# EAGLE design O2_PROM_ISP_A00 (EAGLE 9.6.2)

## Sheet 1 of 2: RP2354B/USB/PWR
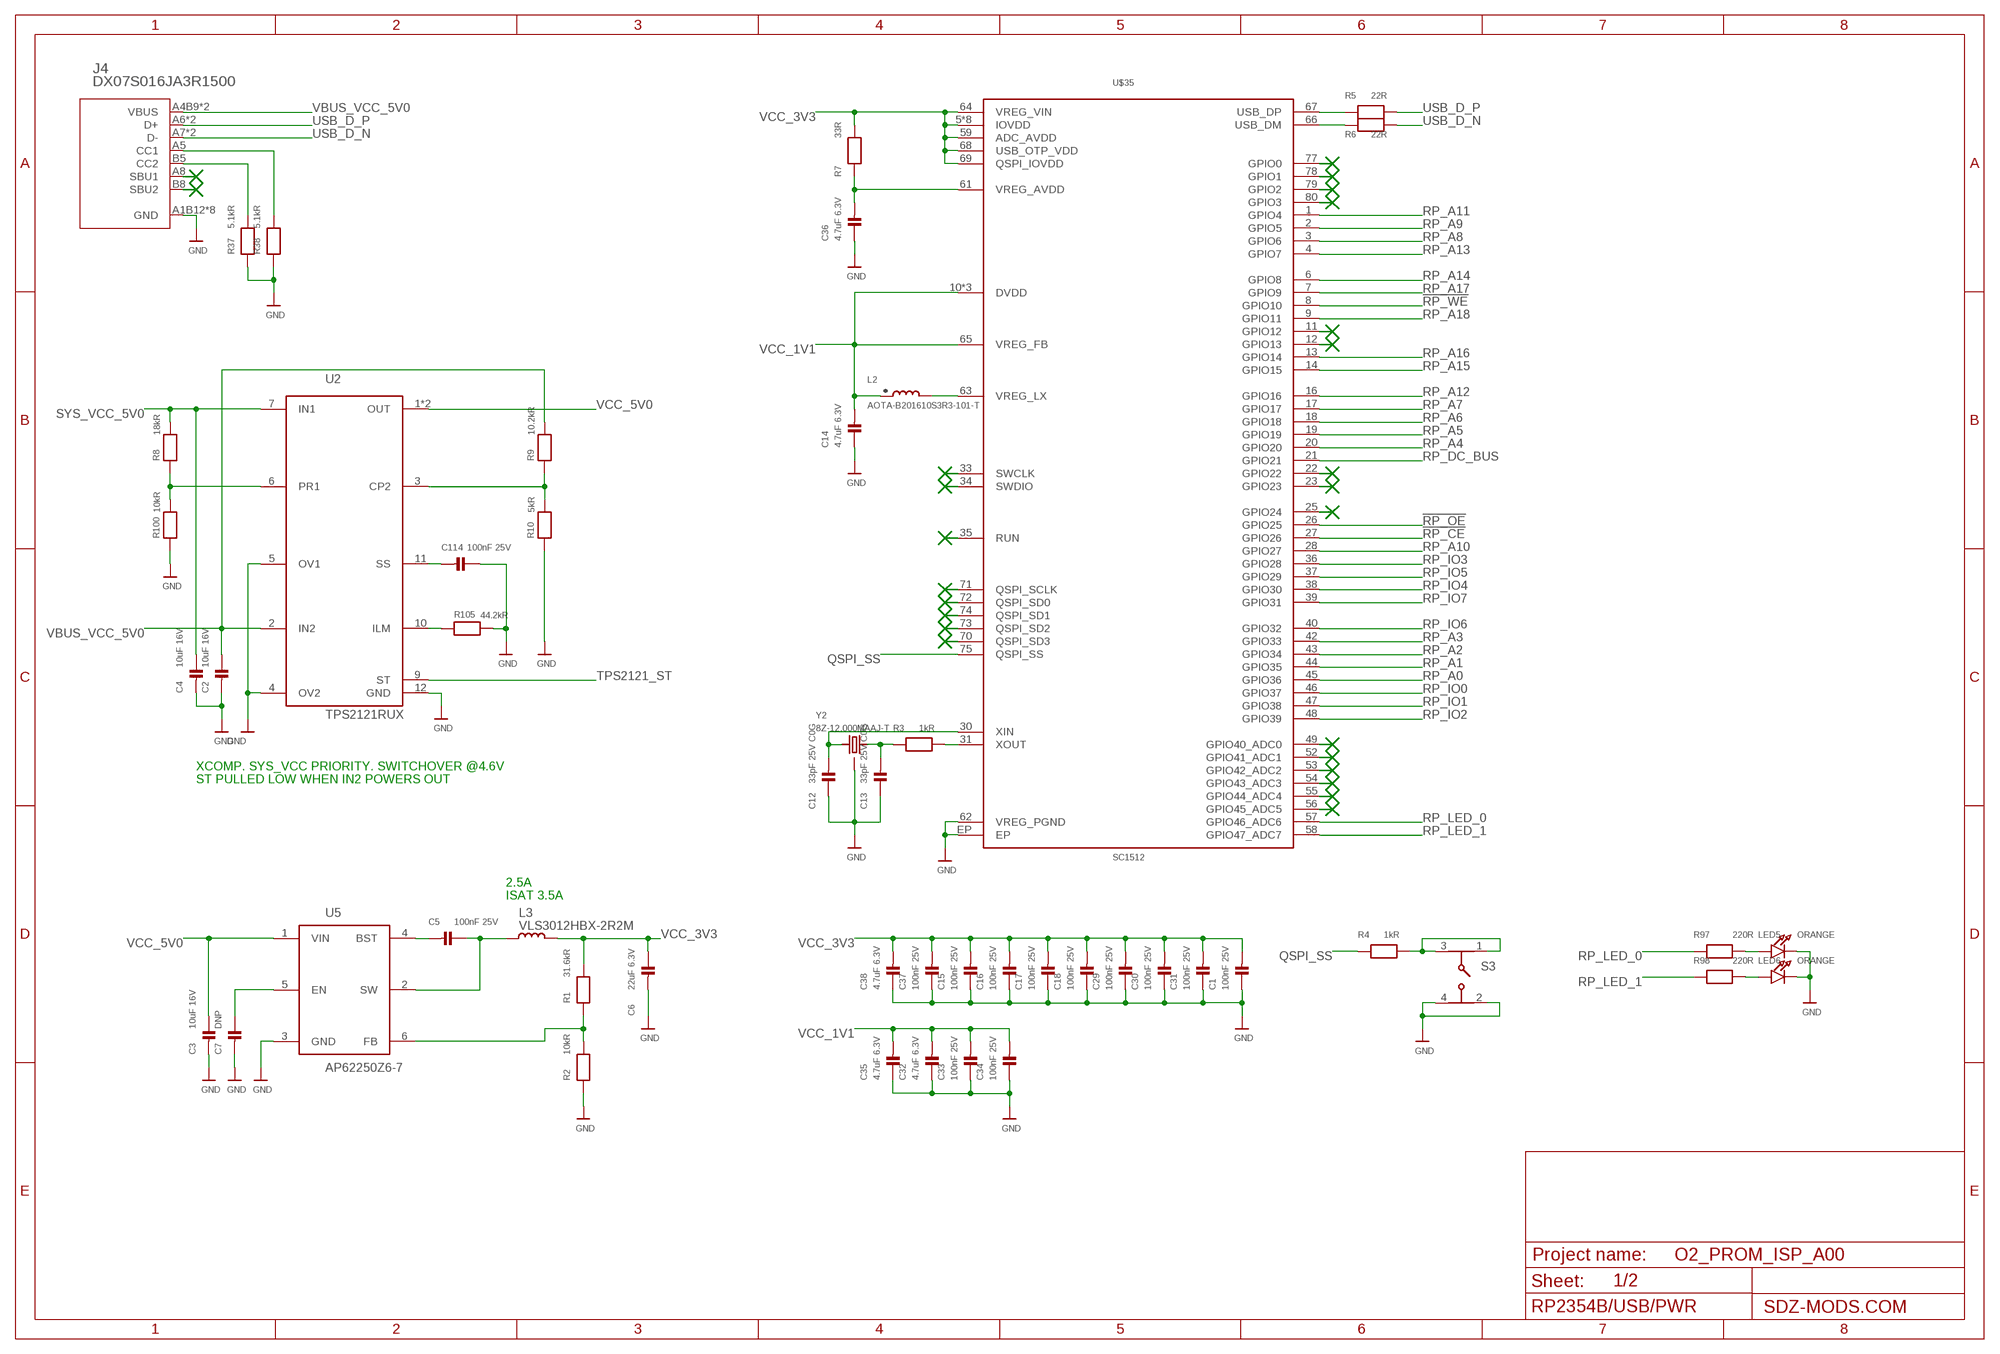
[diagram p0: schematic, sheet 1]

### Parts
C1  100nF 25V  CAP_CERAMIC0402D  [0402D]
C2  10uF 16V  CAP_CERAMIC0603D  [0603D]
C3  10uF 16V  CAP_CERAMIC0603D  [0603D]
C4  10uF 16V  CAP_CERAMIC0603D  [0603D]
C5  100nF 25V  CAP_CERAMIC0402D  [0402D]
C6  22uF 6.3V  CAP_CERAMIC0603D  [0603D]
C7  DNP  CAP_CERAMIC0402D  [0402D]
C12  33pF 25V C0G  CAP_CERAMIC0402D  [0402D]
C13  33pF 25V C0G  CAP_CERAMIC0402D  [0402D]
C14  4.7uF 6.3V  CAP_CERAMIC0402D  [0402D]
C15  100nF 25V  CAP_CERAMIC0402D  [0402D]
C16  100nF 25V  CAP_CERAMIC0402D  [0402D]
C17  100nF 25V  CAP_CERAMIC0402D  [0402D]
C18  100nF 25V  CAP_CERAMIC0402D  [0402D]
C29  100nF 25V  CAP_CERAMIC0402D  [0402D]
C30  100nF 25V  CAP_CERAMIC0402D  [0402D]
C31  100nF 25V  CAP_CERAMIC0402D  [0402D]
C32  4.7uF 6.3V  CAP_CERAMIC0402D  [0402D]
C33  100nF 25V  CAP_CERAMIC0402D  [0402D]
C34  100nF 25V  CAP_CERAMIC0402D  [0402D]
C35  4.7uF 6.3V  CAP_CERAMIC0402D  [0402D]
C36  4.7uF 6.3V  CAP_CERAMIC0402D  [0402D]
C37  100nF 25V  CAP_CERAMIC0402D  [0402D]
C38  4.7uF 6.3V  CAP_CERAMIC0402D  [0402D]
C114  100nF 25V  CAP_CERAMIC0402D  [0402D]
J4  DX07S016JA3R1500  [DX07S016JA3R1500]
L2  AOTA-B201610S3R3-101-T  [0806]
L3  VLS3012HBX-2R2M  [VLS3012]
LED5  ORANGE  LED  [CHIPLED_0402C]
LED6  ORANGE  LED  [CHIPLED_0402C]
R1  31.6kR  RESISTOR0402D  [0402D]
R2  10kR  RESISTOR0402D  [0402D]
R3  1kR  RESISTOR0402D  [0402D]
R4  1kR  RESISTOR0402D  [0402D]
R5  22R  RESISTOR0402D  [0402D]
R6  22R  RESISTOR0402D  [0402D]
R7  33R  RESISTOR0402D  [0402D]
R8  18kR  RESISTOR0402D  [0402D]
R9  10.2kR  RESISTOR0402D  [0402D]
R10  5kR  RESISTOR0402D  [0402D]
R37  5.1kR  RESISTOR0402D  [0402D]
R38  5.1kR  RESISTOR0402D  [0402D]
R97  220R  RESISTOR0402D  [0402D]
R98  220R  RESISTOR0402D  [0402D]
R100  10kR  RESISTOR0402D  [0402D]
R105  44.2kR  RESISTOR0402D  [0402D]
S3  434353045816  [434353045816]
U2  TPS2121RUX  [VQFN-HR-12]
U5  AP62250Z6-7  [SOTFL50P160X60-6N]
U$35  SC1512  [SC1512]
Y2  8Z-12.000MAAJ-T  TXC-8Z-25X20  [TXC-8Z-25X20]

### Nets
!RP_CE: U$35.27(GPIO26) ; also sheet 2
!RP_OE: U$35.26(GPIO25) ; also sheet 2
!RP_WE: U$35.8(GPIO10) ; also sheet 2
GND: C1.3 C2.2 C3.2 C4.2 C6.2 C7.4 C12.3 C13.3 C14.3 C15.3 C16.3 C17.3 C18.3 C29.3 C30.3 C31.3 C32.3 C33.3 C34.3 C35.3 C36.3 C37.3 C38.3 C114.3 J4.A1B12(GND) J4.A12/B1(GND) J4.MH1(GND) J4.MH2(GND) J4.MH3(GND) J4.MH4(GND) J4.MP1(GND) J4.MP2(GND) LED5.4(C) LED6.4(C) R2.4 R10.3 R37.3 R38.3 R100.3 R105.4 S3.2 S3.4 U2.4(OV2) U2.5(OV1) U2.12(GND) U5.3(GND) U$35.62(VREG_PGND) U$35.EP Y2.2(GND) Y2.4(GND) ; also sheet 2
N$1: J4.A5(CC1) R38.4
N$2: R9.3 R10.4 U2.3(CP2)
N$3: J4.B5(CC2) R37.4
N$4: LED5.3(A) R97.3
N$5: LED6.3(A) R98.3
N$7: C13.4 R3.3 Y2.3
N$8: C12.4 U$35.30(XIN) Y2.1
N$9: R3.4 U$35.31(XOUT)
N$10: R4.4 S3.1 S3.3
N$13: L2.2 U$35.63(VREG_LX)
N$16: C5.4 U5.4(BST)
N$17: C5.3 L3.1 U5.2(SW)
N$18: R1.4 R2.3 U5.6(FB)
N$19: C7.3 U5.5(EN)
N$20: C36.4 R7.4 U$35.61(VREG_AVDD)
N$21: C114.4 U2.11(SS)
N$22: R105.3 U2.10(ILM)
N$23: R8.3 R100.4 U2.6(PR1)
QSPI_SS: R4.3 U$35.75(QSPI_SS)
RP_A0: U$35.45(GPIO36) ; also sheet 2
RP_A1: U$35.44(GPIO35) ; also sheet 2
RP_A2: U$35.43(GPIO34) ; also sheet 2
RP_A3: U$35.42(GPIO33) ; also sheet 2
RP_A4: U$35.20(GPIO20) ; also sheet 2
RP_A5: U$35.19(GPIO19) ; also sheet 2
RP_A6: U$35.18(GPIO18) ; also sheet 2
RP_A7: U$35.17(GPIO17) ; also sheet 2
RP_A8: U$35.3(GPIO6) ; also sheet 2
RP_A9: U$35.2(GPIO5) ; also sheet 2
RP_A10: U$35.28(GPIO27) ; also sheet 2
RP_A11: U$35.1(GPIO4) ; also sheet 2
RP_A12: U$35.16(GPIO16) ; also sheet 2
RP_A13: U$35.4(GPIO7) ; also sheet 2
RP_A14: U$35.6(GPIO8) ; also sheet 2
RP_A15: U$35.14(GPIO15) ; also sheet 2
RP_A16: U$35.13(GPIO14) ; also sheet 2
RP_A17: U$35.7(GPIO9) ; also sheet 2
RP_A18: U$35.9(GPIO11) ; also sheet 2
RP_DC_BUS: U$35.21(GPIO21) ; also sheet 2
RP_IO0: U$35.46(GPIO37) ; also sheet 2
RP_IO1: U$35.47(GPIO38) ; also sheet 2
RP_IO2: U$35.48(GPIO39) ; also sheet 2
RP_IO3: U$35.36(GPIO28) ; also sheet 2
RP_IO4: U$35.38(GPIO30) ; also sheet 2
RP_IO5: U$35.37(GPIO29) ; also sheet 2
RP_IO6: U$35.40(GPIO32) ; also sheet 2
RP_IO7: U$35.39(GPIO31) ; also sheet 2
RP_LED_0: R97.4 U$35.57(GPIO46_ADC6)
RP_LED_1: R98.4 U$35.58(GPIO47_ADC7)
SYS_VCC_5V0: C4.1 R8.4 U2.7(IN1) ; also sheet 2
TPS2121_ST: U2.9(ST) ; also sheet 2
USB_D_C_N: R6.3 U$35.66(USB_DM)
USB_D_C_P: R5.3 U$35.67(USB_DP)
USB_D_N: J4.A7(D-) J4.B7(D-) R6.4
USB_D_P: J4.A6(D+) J4.B6(D+) R5.4
VBUS_VCC_5V0: C2.1 J4.A4B9(VBUS) J4.B4A9(VBUS) R9.4 U2.2(IN2)
VCC_1V1: C14.4 C32.4 C33.4 C34.4 C35.4 L2.1 U$35.10(DVDD) U$35.32(DVDD) U$35.51(DVDD) U$35.65(VREG_FB)
VCC_3V3: C1.4 C6.1 C15.4 C16.4 C17.4 C18.4 C29.4 C30.4 C31.4 C37.4 C38.4 L3.2 R1.3 R7.3 U$35.5(IOVDD) U$35.15(IOVDD) U$35.24(IOVDD) U$35.29(IOVDD) U$35.41(IOVDD) U$35.50(IOVDD) U$35.59(ADC_AVDD) U$35.60(IOVDD) U$35.64(VREG_VIN) U$35.68(USB_OTP_VDD) U$35.69(QSPI_IOVDD) U$35.76(IOVDD)
VCC_5V0: C3.1 U2.1(OUT) U2.8(OUT) U5.1(VIN) ; also sheet 2
Unconnected: J4.A8(SBU1) J4.B8(SBU2) U$35.11(GPIO12) U$35.12(GPIO13) U$35.22(GPIO22) U$35.23(GPIO23) U$35.25(GPIO24) U$35.33(SWCLK) U$35.34(SWDIO) U$35.35(RUN) U$35.49(GPIO40_ADC0) U$35.52(GPIO41_ADC1) U$35.53(GPIO42_ADC2) U$35.54(GPIO43_ADC3) U$35.55(GPIO44_ADC4) U$35.56(GPIO45_ADC5) U$35.70(QSPI_SD3) U$35.71(QSPI_SCLK) U$35.72(QSPI_SD0) U$35.73(QSPI_SD2) U$35.74(QSPI_SD1) U$35.77(GPIO0) U$35.78(GPIO1) U$35.79(GPIO2) U$35.80(GPIO3)

### Notes on the sheet
- XCOMP. SYS_VCC PRIORITY. SWITCHOVER @4.6V
- ST PULLED LOW WHEN IN2 POWERS OUT
- 2.5A
- ISAT 3.5A

## Sheet 2 of 2: FLASH/BUS_SWITCH/CTRL
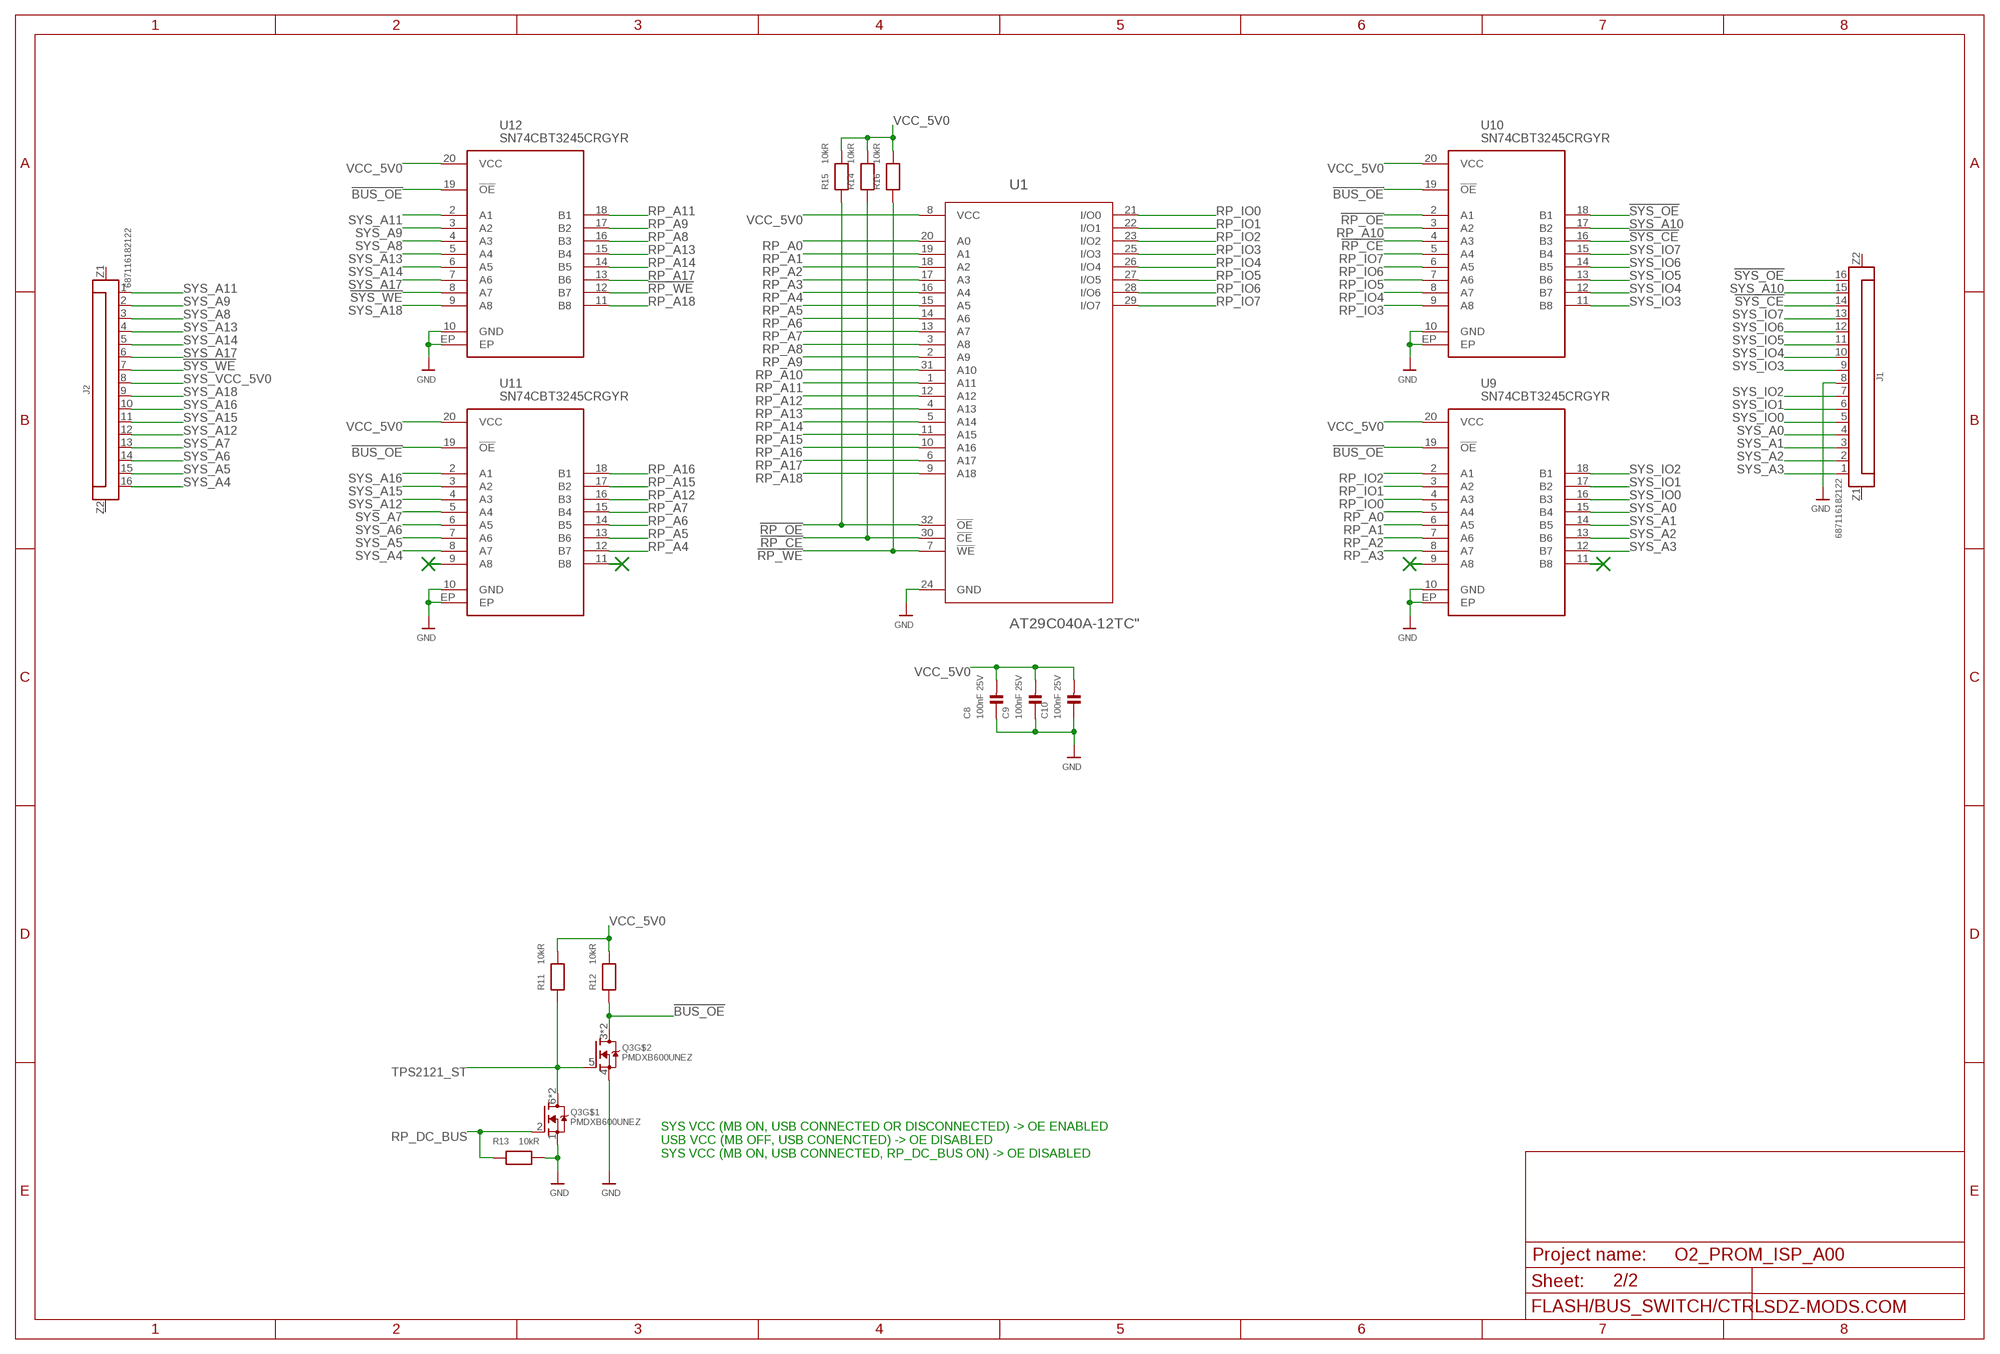
[diagram p1: schematic, sheet 2]

### Parts
C8  100nF 25V  CAP_CERAMIC0402D  [0402D]
C9  100nF 25V  CAP_CERAMIC0402D  [0402D]
C10  100nF 25V  CAP_CERAMIC0402D  [0402D]
J1  687116182122  6871XX182122_687116182122  [687116182122]
J2  687116182122  6871XX182122_687116182122  [687116182122]
Q3  PMDXB600UNEZ  [PMDXB600UNEZ]
R11  10kR  RESISTOR0402D  [0402D]
R12  10kR  RESISTOR0402D  [0402D]
R13  10kR  RESISTOR0402D  [0402D]
R14  10kR  RESISTOR0402D  [0402D]
R15  10kR  RESISTOR0402D  [0402D]
R16  10kR  RESISTOR0402D  [0402D]
U1  AT29C040A-12TC"  [TSOP32_8X20]
U9  SN74CBT3245CRGYR  [VQFN-20]
U10  SN74CBT3245CRGYR  [VQFN-20]
U11  SN74CBT3245CRGYR  [VQFN-20]
U12  SN74CBT3245CRGYR  [VQFN-20]

### Nets
!BUS_OE: Q3.3(D) Q3.8(D) R12.4 U9.19(!OE) U10.19(!OE) U11.19(!OE) U12.19(!OE)
!RP_CE: R14.4 U1.30(!CE) U10.4(A3) ; also sheet 1
!RP_OE: R15.4 U1.32(!OE) U10.2(A1) ; also sheet 1
!RP_WE: R16.4 U1.7(!WE) U12.12(B7) ; also sheet 1
!SYS_CE: J1.14 U10.16(B3)
!SYS_OE: J1.16 U10.18(B1)
!SYS_WE: J2.7 U12.8(A7)
GND: C8.3 C9.3 C10.3 J1.8 Q3.1(S) Q3.4(S) R13.3 U1.24(GND) U9.10(GND) U9.EP U10.10(GND) U10.EP U11.10(GND) U11.EP U12.10(GND) U12.EP ; also sheet 1
RP_A0: U1.20(A0) U9.5(A4) ; also sheet 1
RP_A1: U1.19(A1) U9.6(A5) ; also sheet 1
RP_A2: U1.18(A2) U9.7(A6) ; also sheet 1
RP_A3: U1.17(A3) U9.8(A7) ; also sheet 1
RP_A4: U1.16(A4) U11.12(B7) ; also sheet 1
RP_A5: U1.15(A5) U11.13(B6) ; also sheet 1
RP_A6: U1.14(A6) U11.14(B5) ; also sheet 1
RP_A7: U1.13(A7) U11.15(B4) ; also sheet 1
RP_A8: U1.3(A8) U12.16(B3) ; also sheet 1
RP_A9: U1.2(A9) U12.17(B2) ; also sheet 1
RP_A10: U1.31(A10) U10.3(A2) ; also sheet 1
RP_A11: U1.1(A11) U12.18(B1) ; also sheet 1
RP_A12: U1.12(A12) U11.16(B3) ; also sheet 1
RP_A13: U1.4(A13) U12.15(B4) ; also sheet 1
RP_A14: U1.5(A14) U12.14(B5) ; also sheet 1
RP_A15: U1.11(A15) U11.17(B2) ; also sheet 1
RP_A16: U1.10(A16) U11.18(B1) ; also sheet 1
RP_A17: U1.6(A17) U12.13(B6) ; also sheet 1
RP_A18: U1.9(A18) U12.11(B8) ; also sheet 1
RP_DC_BUS: Q3.2(G) R13.4 ; also sheet 1
RP_IO0: U1.21(I/O0) U9.4(A3) ; also sheet 1
RP_IO1: U1.22(I/O1) U9.3(A2) ; also sheet 1
RP_IO2: U1.23(I/O2) U9.2(A1) ; also sheet 1
RP_IO3: U1.25(I/O3) U10.9(A8) ; also sheet 1
RP_IO4: U1.26(I/O4) U10.8(A7) ; also sheet 1
RP_IO5: U1.27(I/O5) U10.7(A6) ; also sheet 1
RP_IO6: U1.28(I/O6) U10.6(A5) ; also sheet 1
RP_IO7: U1.29(I/O7) U10.5(A4) ; also sheet 1
SYS_A0: J1.4 U9.15(B4)
SYS_A1: J1.3 U9.14(B5)
SYS_A2: J1.2 U9.13(B6)
SYS_A3: J1.1 U9.12(B7)
SYS_A4: J2.16 U11.8(A7)
SYS_A5: J2.15 U11.7(A6)
SYS_A6: J2.14 U11.6(A5)
SYS_A7: J2.13 U11.5(A4)
SYS_A8: J2.3 U12.4(A3)
SYS_A9: J2.2 U12.3(A2)
SYS_A10: J1.15 U10.17(B2)
SYS_A11: J2.1 U12.2(A1)
SYS_A12: J2.12 U11.4(A3)
SYS_A13: J2.4 U12.5(A4)
SYS_A14: J2.5 U12.6(A5)
SYS_A15: J2.11 U11.3(A2)
SYS_A16: J2.10 U11.2(A1)
SYS_A17: J2.6 U12.7(A6)
SYS_A18: J2.9 U12.9(A8)
SYS_IO0: J1.5 U9.16(B3)
SYS_IO1: J1.6 U9.17(B2)
SYS_IO2: J1.7 U9.18(B1)
SYS_IO3: J1.9 U10.11(B8)
SYS_IO4: J1.10 U10.12(B7)
SYS_IO5: J1.11 U10.13(B6)
SYS_IO6: J1.12 U10.14(B5)
SYS_IO7: J1.13 U10.15(B4)
SYS_VCC_5V0: J2.8 ; also sheet 1
TPS2121_ST: Q3.5(G) Q3.6(D) Q3.7(D) R11.4 ; also sheet 1
VCC_5V0: C8.4 C9.4 C10.4 R11.3 R12.3 R14.3 R15.3 R16.3 U1.8(VCC) U9.20(VCC) U10.20(VCC) U11.20(VCC) U12.20(VCC) ; also sheet 1
Unconnected: J1.Z1 J1.Z2 J2.Z1 J2.Z2 U9.9(A8) U9.11(B8) U11.9(A8) U11.11(B8)

### Notes on the sheet
- SYS VCC (MB ON, USB CONNECTED OR DISCONNECTED) -> OE ENABLED
  USB VCC (MB OFF, USB CONENCTED) -> OE DISABLED
  SYS VCC (MB ON, USB CONNECTED, RP_DC_BUS ON) -> OE DISABLED

## Library data of the parts
C1-C10 C12-C18 C29-C38 C114 = microbuilder:CAP_CERAMIC: Ceramic Capacitors 0402 - 0402 Surface Mount Capacitors 16pF 50V 5% [Digikey: 445-4899-2-ND] 18pF 50V 5% [Digikey: 490-1281-2-ND] 22pF 50V 5% [Digikey: 490-1283-2-ND] 68pF 50V 5% [Digikey: 490-1289-2-ND] 0.1uF 10V 10% [Digikey: 490-1318-2-ND] 1.0uF 6.3V 10% [Digikey: 490-1320-2-ND] 0603 - 0603 Surface Mount Capacitors 16 pF 50V 5% [Digikey: 445-5051-2-ND] 22 pF 50V [Digikey: PCC220ACVTR-ND] 33 pF 50V 5% [Digikey: 490-1415-1-ND] 56pF 50V 5% [Digikey: 490-1421-1-ND] 220pF 50V 5% [Digikey: 445-1285-1-ND] 680 pF 50V 2200 pF 50V 5% C0G [Digikey: 445-1297-1-ND] 5600 pF 100V 5% X7R [Digikey: 478-3711-1-ND] 0.1 µF 25V 10% [Digikey: PCC2277TR-ND] 0.22 µF 16V 10% X7R [Digikey: 445-1318-1-ND] 1.0 µF 25V 10% [Digikey: 445-5146-2-ND] 0603 - RF Specific 3pF 250V +/-0.1pF RF [Digikey: 712-1347-1-ND] 18 pF 250V 5% [Digikey: 478-3505-1-ND or 712-1322-1-ND] 56 pF 250V 5% C0G RF [Digikey: 490-4867-1-ND] 68 pF 250V RF [Digikey: 490-4868-1-ND] 0805 - 0805 Surface Mount Capacitors 220 pF 250V 2% RF Ceramic Capacitor [Digikey: 712-1398-1-ND] 1000 pF 50V 2% NP0 Ceramic Capacitor [Digikey: 478-3760-1-ND] 0.1 µF 25V 10% Ceramic Capacitor [Digikey: PCC1828TR-ND] 1.0 µF 16V 10% Ceramic Capacitor[Digikey: 490-1691-2-ND] 10.0 µF 10V 10% Ceramic Capacitor[Digikey: 709-1228-1-ND] 10.0 uF 16V 10% Ceramic Capacitor [Digikey: 478-5165-2-ND] 47 uF 6.3V 20% Ceramic Capacitor [Digikey: 587-1779-1-ND or 399-5506-1-ND] 1206 - 1206 Surface Mount Capacitors 47uF 10V 20% Ceramic Capacitor [Digikey: 490-5528-1-ND or 399-5508-1-ND or 445-6010-1-ND] 100uF 6.3V -20%, +80% Y5V Ceramic Capacitor (Digikey: 490-4512-1-ND, Mouser: 81-GRM31CF50J107ZE1L)
J1 J2 = Eagle_WR-FPC (rev24a):6871XX182122_687116182122: WR-FPC 0.50 mm SMT ZIF Horizontal Dual Contact KIND PROPERTIES Pitch 0.5 mm MATERIAL PROPERTIES Insulator Material LCP Contact Material Phosphor Bronze Contact Plating 80 (µ") Tin over 50 (µ") Nickel Contact Type Stamped Solder Tabs Brass <https://www.we-online.com/catalog/media/o73336v209%20Family_WR-FPC_687186182122.jpg> Details see: https://www.we-online.com/catalog/en/FPC_0_5_SMT_ZIF_HORIZONTAL_DUAL_CONTACT_BACK_LOCKING_6871XX182122/ Updated by Ella Wu 2020-08-26 2020(C) Wurth Elektronik; CONTACT-RESISTANCE: 30mOhm; DATASHEET-URL: https://www.we-online.com/redexpert/spec/687116182122?ae; IR: 0.5A; L: 10mm; PACKAGING: Tape and Reel; PART-NUMBER: 687116182122; PINS: 16; PITCH: 0.5mm; TYPE: Horizontal; WORKING-VOLTAGE: 50V(AC)
J4 = DX07S016JA3R1500:DX07S016JA3R1500
L2 = AOTA-B201610S3R3-101-T:AOTA-B201610S3R3-101-T
L3 = VLS3012HBX-2R2M:VLS3012HBX-2R2M: Fixed Inductors 3x3x1.2mm 2.2uH 20% Magnetic Pwr Inductr Source: Datasheet <https://product.tdk.com/system/files/dam/doc/product/inductor/inductor/smd/catalog/inductor_commercial_power_vls3012hbx_en.pdf>; DESCRIPTION: Fixed Inductors 3x3x1.2mm 2.2uH 20% Magnetic Pwr Inductr; HEIGHT: mm; MANUFACTURER_NAME: TDK; MANUFACTURER_PART_NUMBER: VLS3012HBX-2R2M; MOUSER_PART_NUMBER: 810-VLS3012HBX-2R2M; MOUSER_PRICE-STOCK: https://www.mouser.co.uk/ProductDetail/TDK/VLS3012HBX-2R2M?qs=pfd5qewlna6oSgcfnWnTMg%3D%3D
LED5 LED6 = microbuilder:LED: LED 0603 - 0603 Surface Mount Package 2mA: Green LED - Low Power (3.9mcd, 2ma, 1.7Vf) - Digikey: 475-2709-2-ND Orange LED - Low Power (9.8mcd, 2ma, 1.8Vf) - Digikey: 475-1194-2-ND Red LED - Low Power (5mcd, 2ma, 1.8Vf) - Digikey: 475-1195-2-ND Yellow LED - Low Power (7mcd, 2ma, 1.8Vf) - Digikey: 475-1196-2-ND 5mA: Blue LED - Low Power (17mcd, 5ma, 2.9Vf) - Digikey: LNJ937W8CRACT-ND 0805 - 0805 Surface Mount Package 2mA: Red LED (8.8mcd, 2mA, 1.8Vf, Clear) - Low Power [Digikey: 475-2510-1-ND] Green LED (5mcd, 2mA, 1.8Vf, Clear) - Low Power [Digikey: 475-2730-1-ND] Yellow LED (11.3mcd, 2mA, 1.8Vf, Clear) - Low Power [Digikey: 475-2555-1-ND] 20mA: Red LED (104mcd, 20mA, Diffused) - LS R976 [Digikey: 475-1278-6-ND] Red LED (12mcd, 20mA, 2.0Vf, Clear) - APT2012EC [Digikey: 754-1128-1-ND] Green LED (15mcd, 20mA, 2.2Vf, Clear) - APT2012GC [Digikey: 754-1131-1-ND] Orange LED (160mcd, 20mA, 2.1Vf, Clear) - APT2012SECK [Digikey: 754-1130-1-ND] 1206 - 1206 Surface Mount Package Green LED (26mcd, 20mA, Diffused) - LG N971 [Digikey: 475-1407-6-ND] Red LED (15mcd, 20mA, Diffused) - LH N974 [Digikey: 475-1416-6-ND]
Q3 = PMDXB600UNEZ:PMDXB600UNEZ: PMDXB600UNEZ Hex N-Channel MOSFET, 600 mA, 20 V, 8-Pin DFN1010B-6, SOT1216 Nexperia Source: Datasheet <http://assets.nexperia.com/documents/data-sheet/PMDXB600UNE.pdf>; DESCRIPTION: PMDXB600UNEZ Hex N-Channel MOSFET, 600 mA, 20 V, 8-Pin DFN1010B-6, SOT1216 Nexperia; HEIGHT: 0.4mm; MANUFACTURER_NAME: Nexperia; MANUFACTURER_PART_NUMBER: PMDXB600UNEZ; MOUSER_PART_NUMBER: 771-PMDXB600UNEZ; MOUSER_PRICE-STOCK: https://www.mouser.co.uk/ProductDetail/Nexperia/PMDXB600UNEZ/?qs=gNSudQoqUYA4PlgBT4gR6w%3D%3D
R1-R16 R37 R38 R97 R98 R100 R105 = microbuilder:RESISTOR: Resistors 0402 - 0402 Surface Mount Package 22 Ohm 1% 1/16W [Digikey: 311-22.0LRTR-ND] 33 Ohm 5% 1/16W 1.0K 5% 1/16W 1.5K 5% 1/16W 2.0K 1% 1/16W 10.0K 1% 1/16W [Digikey: 311-10.0KLRTR-ND] 10.0K 5% 1/16W [Digikey: RMCF0402JT10K0TR-ND] 12.1K 1% 1/16W [Digikey: 311-22.0LRTR-ND] 100.0K 5% 1/16W 0603 - 0603 Surface Mount Package 0 Ohm 1/10 Watt 1% Resistor 15 Ohm 1/10 Watt 1% Resistor 33 Ohm 1/10 Watt 1% Resistor 49.9 Ohm 1/10 Watt 1% Resistor 100 Ohm 1/10 Watt 1% Resistor 150 Ohm 1/10 Watt 1% Resistor 240 Ohm 1/10 Watt 1% Resistor 390 Ohm 1/10 Watt 1% Resistor 560 Ohm 1/10 Watt 1% Resistor 680 Ohm 1/10 Watt 1% Resistor 750 Ohm 1/10 Watt 1% Resistor 1.0K Ohm 1/10 Watt 1% Resistor 1.5K Ohm 1/10 Watt 1% Resistor 2.0K Ohm 1/10 Watt 1% Resistor 2.2K Ohm 1/10 Watt 1% Resistor 3.3K Ohm 1/10 Watt 1% Resistor 4.7K Ohm 1/10 Watt 1% Resistor 10.0K Ohm 1/10 Watt 1% Resistor 12.0K Ohm 1/10 Watt 1% Resistor 12.1K Ohm 1/10 Watt 1% Resistor 20.0K Ohm 1/10 Watt 1% Resistor 33.0K Ohm 1/10 Watt 1% Resistor 100.0K Ohm 1/10 Watt 1% Resistor 0805 - 0805 Surface Mount Package 0 Ohm 1/8 Watt 1% Resistor 33 Ohm 1/8 Watt 1% Resistor 100 Ohm 1/8 Watt 1% Resistor 150 Ohm 1/8 Watt 1% Resistor 200 Ohm 1/8 Watt 1% Resistor 240 Ohm 1/8 Watt 1% Resistor 330 Ohm 1/8 Watt 1% Resistor 390 Ohm 1/8 Watt 1% Resistor 470 Ohm 1/8 Watt 1% Resistor 1.0K Ohm 1/8 Watt 1% Resistor 1.5K Ohm 1/8 Watt 1% Resistor 2.0K Ohm 1/8 Watt 1% Resistor 4.7K Ohm 1/8 Watt 1% Resistor 5.1K Ohm 1/8 Watt 1% Resistor 5.6K Ohm 1/8 Watt 1% Resistor 10.0K Ohm 1/8 Watt 1% Resistor 22.0K Ohm 1/8 Watt 1% Resistor 33.0K Ohm 1/8 Watt 1% Resistor 100K Ohm 1/8 Watt 1% Resistor 1206 - 1206 Surface Mount Package 2012 - 2010 Surface Mount Package 0.11 Ohm 1/2 Watt 1% Resistor - Digikey: RHM.11UCT-ND
S3 = Eagle_SWITCHES(rev19a):434353045816: 3.5x4.7 mm SMD J-Bend side push WS-TASU <http://katalog.we-online.de/media/images/v2/Family_WS_TUS_Normal_SMD_J-Bend_4343x30458xx_pf2.jpg> Details see: http://katalog.we-online.de/em/datasheet/4343x30458xx.pdf 2015 (C) Wurth Elektronik
U1 = AT29C040A-12TC:AT29C040A-12TC
U2 = TPS2121RUX:TPS2121RUX
U5 = AP62250Z6-7:AP62250Z6-7: Switching Voltage Regulators DCDC Conv HV Buck SOT563 T&R 3K Source: Datasheet <https://www.diodes.com/assets/Datasheets/AP62250.pdf>; DESCRIPTION: Switching Voltage Regulators DCDC Conv HV Buck SOT563 T&R 3K; HEIGHT: 0.6mm; MANUFACTURER_NAME: Diodes Inc.; MANUFACTURER_PART_NUMBER: AP62250Z6-7; MOUSER_PART_NUMBER: 621-AP62250Z6-7; MOUSER_PRICE-STOCK: https://www.mouser.co.uk/ProductDetail/Diodes-Incorporated/AP62250Z6-7?qs=7MVldsJ5UazFBrGnyLje6A%3D%3D
U9-U12 = SN74CBT3245CRGYR:SN74CBT3245CRGYR
U$35 = SC1512:SC1512
Y2 = TXC-8Z-25x20:TXC-8Z-25X20

## Board
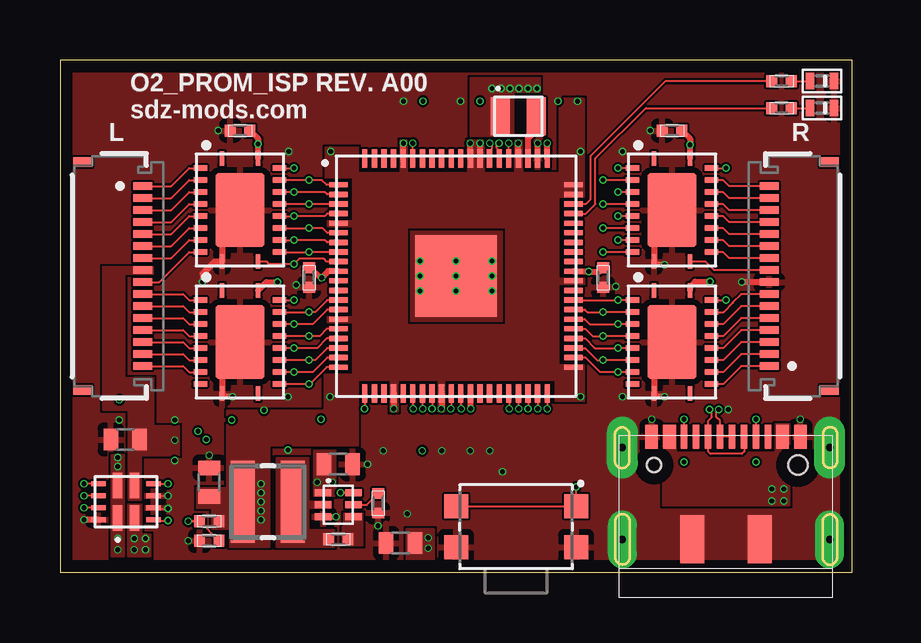
[diagram p2: board, top side]
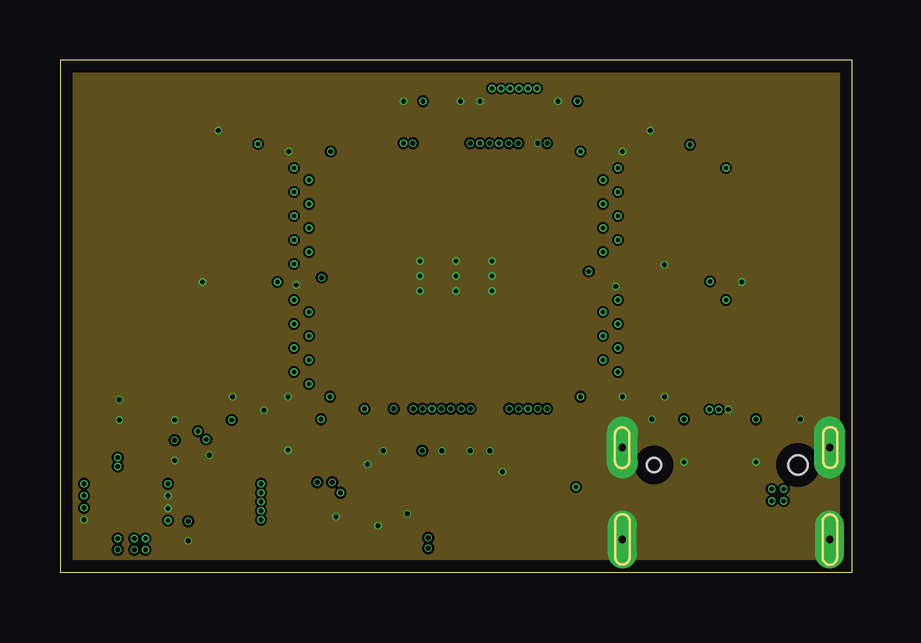
[diagram p3: board, inner layer Route2]
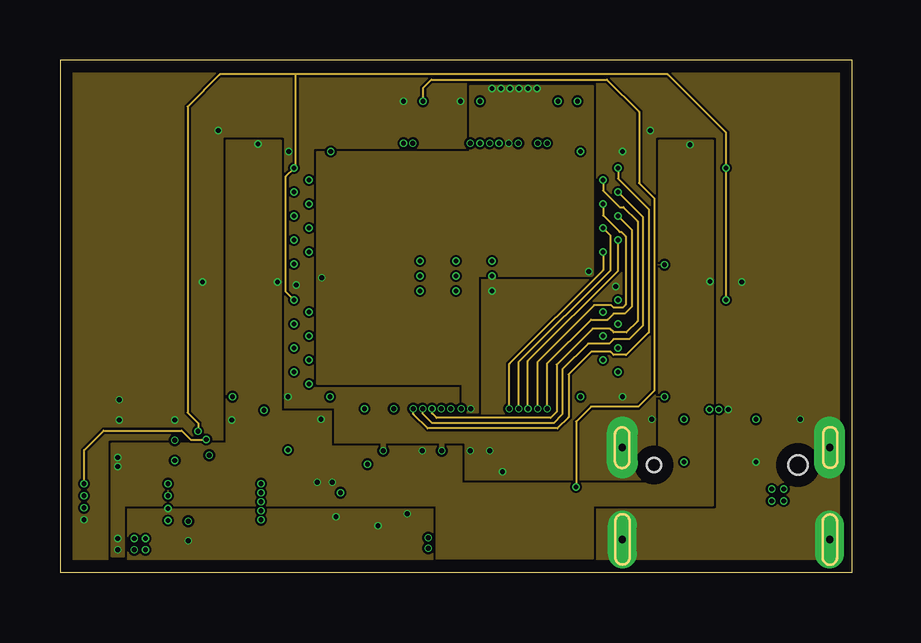
[diagram p4: board, inner layer Route15]
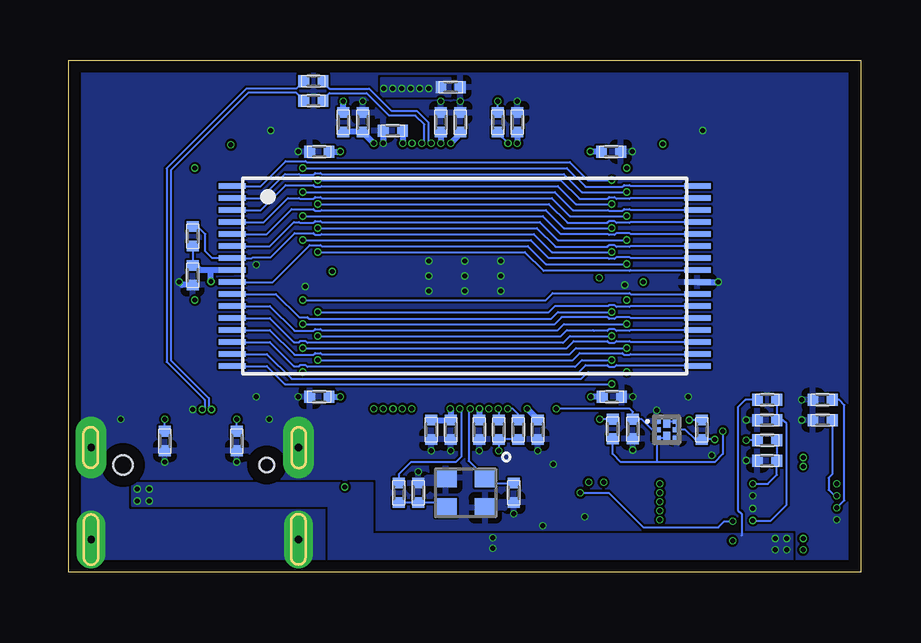
[diagram p5: board, bottom side, seen from below]

Size 33 x 21.35 mm. Coordinates in mm from the lower left corner, seen from the top.
Outline: 33,21.35 0,21.35 0,0 33,0 33,21.35
Copper layers (1+2*15+16): Top 0.035mm / dielectric 1.5mm / Route2 0.035mm / dielectric 0.15mm / Route15 0.035mm / dielectric 0.2mm / Bottom 0.035mm
Design rules "default *": minimum track width 0.09mm, minimum drill 0.2mm, track to track 0.09mm, track to pad 0.09mm, pad to pad 0.09mm, via to via 0.09mm, smd to smd 0.09mm, copper to edge 20mil, drill to drill 6mil, minimum pad ring 7mil, minimum via ring 0.05mm, stop-mask expansion 4mil, vias tented up to drill 0.35mm, thermal gap 10mil

### Footprints (pad centres in the part's own frame; a part is rotated, then mirrored left to right if it is on the bottom)
0402D = smd 0.45 x 0.5: 3 -0.403,0; 4 0.404,0
0603D = smd 0.6 x 0.9: 1 -0.6,0; 2 0.6,0
687116182122 = smd 0.3 x 0.8: 1 -3.75,1.4; 2 -3.25,1.4; 3 -2.75,1.4; 4 -2.25,1.4; 5 -1.75,1.4; 6 -1.25,1.4; 7 -0.75,1.4; 8 -0.25,1.4; 9 0.25,1.4; 10 0.75,1.4; 11 1.25,1.4; 12 1.75,1.4; 13 2.25,1.4; 14 2.75,1.4; 15 3.25,1.4; 16 3.75,1.4 | smd 0.4 x 0.8: Z1 -4.75,-1.1; Z2 4.75,-1.1
DX07S016JA3R1500 = smd 0.52 x 1: A1B12 -3.1,3.546; A4B9 -2.35,3.546; A12/B1 3.1,3.546; B4A9 2.35,3.546 | smd 0.27 x 1: A5 -1.75,3.55; A6 -0.25,3.55; A7 0.75,3.55; A8 1.75,3.55; B5 1.25,3.55; B6 0.25,3.55; B7 -0.75,3.55; B8 -1.25,3.55 | drill 0.3 pad 1.3 long: MH1 -4.32,3.1; MH2 4.32,3.1 | drill 0.3 pad 1.2 long: MH3 -4.32,-0.725; MH4 4.32,-0.725 | smd 1 x 2: MP1 -1.4,-0.725; MP2 1.4,-0.725 | hole 0.6: -3,2.375 | hole 0.8: 3,2.375
0806 = smd 0.8 x 1.6: 1 -0.75,0; 2 0.75,0
VLS3012 = smd 1 x 3.4: 1 -1.05,0; 2 1.05,0
CHIPLED_0402C = smd 0.35 x 0.7: 3 -0.502,0; 4 0.504,0
PMDXB600UNEZ = smd 0.2 x 0.35: 1 -0.35,-0.425; 2 0,-0.425; 3 0.35,-0.425; 4 0.35,0.425; 5 0,0.425; 6 -0.35,0.425 | smd 0.4 x 0.3: 7 -0.275,0; 8 0.275,0
434353045816 = smd 1 x 1: 1 2.5,0.85; 2 2.5,-0.85; 3 -2.5,0.85; 4 -2.5,-0.85
TSOP32_8X20 = smd 1.118 x 0.229: 1 -9.69,3.75; 2 -9.69,3.25; 3 -9.69,2.75; 4 -9.69,2.25; 5 -9.69,1.75; 6 -9.69,1.25; 7 -9.69,0.75; 8 -9.69,0.25; 9 -9.69,-0.25; 10 -9.69,-0.75; 11 -9.69,-1.25; 12 -9.69,-1.75; 13 -9.69,-2.25; 14 -9.69,-2.75; 15 -9.69,-3.25; 16 -9.69,-3.75; 17 9.69,-3.75; 18 9.69,-3.25; 19 9.69,-2.75; 20 9.69,-2.25; 21 9.69,-1.75; 22 9.69,-1.25; 23 9.69,-0.75; 24 9.69,-0.25; 25 9.69,0.25; 26 9.69,0.75; 27 9.69,1.25; 28 9.69,1.75; 29 9.69,2.25; 30 9.69,2.75; 31 9.69,3.25; 32 9.69,3.75
VQFN-HR-12 = smd 1.05 x 0.4: 1 -0.675,0.35; 2 -0.675,-0.35; 7 0.675,-0.35; 8 0.675,0.35 | smd 0.2 x 0.6: 3 -0.75,-1.15; 4 -0.25,-1.15; 5 0.25,-1.15; 6 0.75,-1.15; 9 0.75,1.15; 10 0.25,1.15; 11 -0.25,1.15; 12 -0.75,1.15
SOTFL50P160X60-6N = smd 0.67 x 0.3: 1 -0.635,0.5; 2 -0.635,0; 3 -0.635,-0.5; 4 0.635,-0.5; 5 0.635,0; 6 0.635,0.5
VQFN-20 = smd 0.24 x 0.6: 1 -0.75,2.15; 10 -0.75,-2.15; 11 0.75,-2.15; 20 0.75,2.15 | smd 0.6 x 0.24: 2 -1.65,1.75; 3 -1.65,1.25; 4 -1.65,0.75; 5 -1.65,0.25; 6 -1.65,-0.25; 7 -1.65,-0.75; 8 -1.65,-1.25; 9 -1.65,-1.75; 12 1.65,-1.75; 13 1.65,-1.25; 14 1.65,-0.75; 15 1.65,-0.25; 16 1.65,0.25; 17 1.65,0.75; 18 1.65,1.25; 19 1.65,1.75 | smd 2.05 x 3.05: EP 0,0
SC1512 = smd 0.78 x 0.22: 1 -4.896,3.8; 2 -4.896,3.4; 3 -4.896,3; 4 -4.896,2.6; 5 -4.896,2.2; 6 -4.896,1.8; 7 -4.896,1.4; 8 -4.896,1; 9 -4.896,0.6; 10 -4.896,0.2; 11 -4.896,-0.2; 12 -4.896,-0.6; 13 -4.896,-1; 14 -4.896,-1.4; 15 -4.896,-1.8; 16 -4.896,-2.2; 17 -4.896,-2.6; 18 -4.896,-3; 19 -4.896,-3.4; 20 -4.896,-3.8; 41 4.896,-3.8; 42 4.896,-3.4; 43 4.896,-3; 44 4.896,-2.6; 45 4.896,-2.2; 46 4.896,-1.8; 47 4.896,-1.4; 48 4.896,-1; 49 4.896,-0.6; 50 4.896,-0.2; 51 4.896,0.2; 52 4.896,0.6; 53 4.896,1; 54 4.896,1.4; 55 4.896,1.8; 56 4.896,2.2; 57 4.896,2.6; 58 4.896,3; 59 4.896,3.4; 60 4.896,3.8 | smd 0.22 x 0.78: 21 -3.8,-4.896; 22 -3.4,-4.896; 23 -3,-4.896; 24 -2.6,-4.896; 25 -2.2,-4.896; 26 -1.8,-4.896; 27 -1.4,-4.896; 28 -1,-4.896; 29 -0.6,-4.896; 30 -0.2,-4.896; 31 0.2,-4.896; 32 0.6,-4.896; 33 1,-4.896; 34 1.4,-4.896; 35 1.8,-4.896; 36 2.2,-4.896; 37 2.6,-4.896; 38 3,-4.896; 39 3.4,-4.896; 40 3.8,-4.896; 61 3.8,4.896; 62 3.4,4.896; 63 3,4.896; 64 2.6,4.896; 65 2.2,4.896; 66 1.8,4.896; 67 1.4,4.896; 68 1,4.896; 69 0.6,4.896; 70 0.2,4.896; 71 -0.2,4.896; 72 -0.6,4.896; 73 -1,4.896; 74 -1.4,4.896; 75 -1.8,4.896; 76 -2.2,4.896; 77 -2.6,4.896; 78 -3,4.896; 79 -3.4,4.896; 80 -3.8,4.896 | smd 3.4 x 3.4: EP 0,0
TXC-8Z-25X20 = smd 0.9 x 0.8: 1 -0.825,-0.625; 2 0.825,-0.625; 3 0.825,0.625; 4 -0.825,0.625

### Placement (x,y rotation side)
C1  10.38,7.32 180 bottom
C2  14.19,1.22 180 top
C3  11.59,4.51 0 top
C4  2.72,5.54 180 top
C5  11.59,1.38 0 top
C6  6.22,3.76 90 top
C7  13.25,2.88 270 top
C8  7.5,18.41 0 top
C9  25.5,18.41 0 top
C10  27.84,12.38 90 bottom
C12  14.47,3.32 90 bottom
C13  18.44,3.32 270 bottom
C14  17.09,20.23 180 bottom
C15  15.91,5.94 90 bottom
C16  16.69,18.76 270 bottom
C17  13.47,5.94 90 bottom
C18  22.56,17.54 0 bottom
C29  22.56,7.32 0 bottom
C30  14.31,18.76 270 bottom
C31  10.41,17.54 180 bottom
C32  17.91,5.94 90 bottom
C33  22.62,12.29 90 top
C34  17.09,5.94 90 bottom
C35  10.38,12.29 90 top
C36  20.75,18.76 270 bottom
C37  17.5,18.76 270 bottom
C38  19.5,18.41 0 bottom
C114  1.59,7.19 0 bottom
J1  30.95,12.35 90 top
J2  2.05,12.35 270 top
J4  27.75,2.1 0 top
L2  19.09,19.01 0 top
L3  8.66,2.94 180 top
LED5  31.75,19.35 0 top
LED6  31.75,20.48 0 top
Q3  8.09,5.94 270 bottom
R1  6.22,2.13 180 top
R2  6.22,1.32 180 top
R3  19.25,3.32 90 bottom
R4  15.12,18.76 90 bottom
R5  22.81,20.48 180 bottom
R6  22.81,19.66 180 bottom
R7  21.56,18.76 270 bottom
R8  3.91,5.51 180 bottom
R9  3.91,7.19 180 bottom
R10  3.91,6.35 0 bottom
R11  6.62,5.94 270 bottom
R12  10.34,5.97 270 bottom
R13  9.5,5.97 90 bottom
R14  15.09,5.94 90 bottom
R15  14.28,5.94 90 bottom
R16  27.84,14.01 90 bottom
R37  29,5.47 90 bottom
R38  26,5.47 90 bottom
R97  30.06,19.35 180 top
R98  30.06,20.48 180 top
R100  3.91,4.66 0 bottom
R105  1.59,6.35 180 bottom
S3  19,1.9 0 top
U1  16.5,12.35 0 bottom
U2  2.75,2.94 90 top
U5  11.59,2.82 0 top
U9  25.5,9.6 0 top
U10  25.5,15.1 0 top
U11  7.5,9.6 0 top
U12  7.5,15.1 0 top
U$35  16.5,12.35 0 top
Y2  16.47,3.32 180 bottom

### Tracks (layer width: path | path; a pad name or v marks a point on that pad's centre or on a via)
!BUS_OE  (via drill 0.2)
  Top 0.09: U11.19 v9.75,11.35 | U12.19 v9.75,16.85 | U10.19 v27.75,16.85 | U9.19 v27.75,11.35
  Route15 0.09: v9.75,11.35 9.41,11.69 9.41,16.51 v9.75,16.85 9.82,16.92 9.82,17.66 9.81,17.66 9.81,20.76 | v27.75,11.35 v27.75,16.85 27.75,18.32 25.31,20.76 9.81,20.76 | 9.81,20.76 6.66,20.76 5.31,19.41 5.31,6.66 5.75,6.22 v5.75,5.88
  Bottom 0.09: R12.4 10.34,4.94 10,4.6 8.5,4.6 | Q3.8 8.17,5.59 Q3.3 8.5,5.57 8.5,4.6 | v5.75,5.88 5.75,4.94 6.1,4.6 8.5,4.6
!RP_CE  (via drill 0.2)
  Top 0.09: U10.4 v23.25,15.85 | U$35.27 v15.1,6.83 v15.11,6.82
  Route15 0.09: v23.25,15.85 24.28,14.82 24.28,10.29 23.72,9.72 23.06,9.72 22.88,9.54 22,9.54 20.93,8.47 20.93,6.6 20.56,6.22 15.5,6.22 15.11,6.61 v15.11,6.82
  Bottom 0.09: v23.25,15.85 12.75,15.85 12,15.1 10.53,15.1 10.49,15.06 9.94,15.06 9.87,15.13 9.63,15.13 9.6,15.1 U1.30 | v15.11,6.82 15.09,6.8 R14.4
!RP_OE  (via drill 0.2)
  Top 0.09: U10.2 v23.25,16.85 | U$35.26 14.7,6.84 v14.72,6.82
  Route15 0.09: v23.25,16.85 23.25,16.41 24.53,15.13 24.53,10.01 23.59,9.06 23.07,9.06 22.94,9.19 22.12,9.19 21.19,8.26 21.19,6.47 20.72,6.01 15.31,6.01 14.72,6.6 v14.72,6.82
  Bottom 0.09: v23.25,16.85 12.25,16.85 11.46,16.06 9.94,16.06 9.87,16.13 9.63,16.13 9.6,16.1 U1.32 | R15.4 14.28,6.6 14.5,6.82 v14.72,6.82
!RP_WE  (via drill 0.2)
  Top 0.09: U12.12 v10.38,13.35 U$35.8
  Bottom 0.09: v10.38,13.35 12.88,13.35 13.62,14.1 22.47,14.1 22.51,14.06 22.74,14.06 22.81,14.13 23.59,14.13 24.59,13.13 25.35,13.13 25.38,13.1 U1.7 27.03,13.1 27.31,13.38 27.31,14.1 27.62,14.41 R16.4
!SYS_CE
  Top 0.09: J1.14 27.88,15.1 27.62,15.35 U10.16
!SYS_OE
  Top 0.09: J1.16 27.88,16.1 27.62,16.35 U10.18
!SYS_WE
  Top 0.09: J2.7 4.62,13.1 5.38,13.85 U12.8
GND  (via drill 0.2)
  Top 0.09: U2.5 v4.5,3.19 | U2.4 3.93,2.66 v4.5,2.66
  Top 0.2: U5.3 v11.5,2.32
  Top 0.254: U$35.62 v19.9,17.88 v19.91,17.88 | J1.8 v28.41,12.1 | U2.12 v1,2.19 | U12.EP 6.75,14.35 U12.10 6.44,12.95 5.94,12.45 v5.94,12.1 | U11.EP 6.75,8.85 U11.10 6.75,7.32 v7.19,7.32 | v25.19,12.82 24.75,12.82 U10.10 24.75,15.1 U10.EP | v25.19,7.32 24.75,7.32 U9.10 24.75,9.6 U9.EP
  Bottom 0.09: Q3.1 8.52,6.74 v8.5,6.76
  Bottom 0.254: C38.3 v19.9,17.88 v19.91,17.88 | C10.3 28.29,11.98 v28.41,12.1 | U1.24 v5.94,12.1
  other vias: 16.5,12.35 18,12.35 15,12.35 15,12.97 16.5,12.97 18,12.97 18,11.72 16.5,11.72 15,11.72 18.44,4.19 14.47,2.44 15.91,5.07 13.47,5.07 23.44,17.54 23.44,7.32 14.31,19.63 16.69,19.63 17.5,19.63 20.75,19.63 9.53,17.54 9.5,7.32 23.16,11.91 9.84,11.97 17.09,5.07 17.91,5.07 27.84,6.79 29,4.6 26,4.6 12.81,4.51 13.25,1.94 6.22,4.88 5.34,1.32 6.59,18.41 24.59,18.41 4.78,6.35 4.78,4.66 2.47,7.19 2.47,6.35 30.84,6.38 24.66,6.38 9.5,5.1
  pour Top (no thermals): 14.62,14.22 18.41,14.22 18.41,10.47 14.62,10.47
  pour Top (rank 5): -0.84,22.01 33.84,22.01 33.84,-0.84 -0.84,-0.84
  pour Route2 (rank 5): -0.84,22.01 33.84,22.01 33.84,-0.84 -0.84,-0.84
  pour Route15 (rank 5): -0.84,22.01 33.84,22.01 33.84,-0.84 -0.84,-0.84
  pour Bottom (rank 5): -0.84,22.01 33.84,22.01 33.84,-0.84 -0.84,-0.84
N$1  (via drill 0.2)
  Top 0.09: J4.A5 v26,6.38
  Bottom 0.09: R38.4 v26,6.38
N$2  (via drill 0.2)
  Top 0.09: U2.3 3.93,2.16 v4.5,2.16
  Bottom 0.09: R9.3 R10.4 3.25,6.35 3.09,6.19 3.09,2.82 3.75,2.16 v4.5,2.16
N$3  (via drill 0.2)
  Top 0.09: J4.B5 v29,6.38
  Bottom 0.09: R37.4 v29,6.38
N$4
  Top 0.09: R97.3 LED5.3
N$5
  Top 0.09: R98.3 LED6.3
N$7
  Bottom 0.09: R3.3 C13.4 17.52,2.91 Y2.3
N$8  (via drill 0.2)
  Top 0.09: U$35.30 16.3,6.84 v16.28,6.82
  Bottom 0.09: C12.4 15.41,3.72 15.63,3.94 Y2.1 16.34,4.64 16.34,6.76 v16.28,6.82
N$9  (via drill 0.2)
  Top 0.09: U$35.31 16.7,6.84 v16.72,6.82
  Bottom 0.09: v16.72,6.82 16.66,6.76 16.66,4.82 16.88,4.6 18.75,4.6 19.25,4.1 R3.4
N$10  (via drill 0.2)
  Top 0.09: S3.3 S3.1 v21.5,3.56
  Route15 0.09: v15.12,19.63 15.12,20.19 15.47,20.54 22.78,20.54 24.12,19.19 24.12,16.23 24.75,15.6 24.75,7.57 24.09,6.91 22.12,6.91 21.5,6.29 v21.5,3.56
  Bottom 0.09: R4.4 v15.12,19.63
N$13
  Top 0.254: U$35.63 19.5,18.1 19.84,18.44 L2.2
N$16
  pour Top (no thermals): 11.84,2.44 12.59,2.44 12.59,1.13 11.78,1.13 11.78,1.88 11.84,1.88
N$17
  pour Top (no thermals): 9.03,4.76 10.34,4.76 10.34,2.94 11.28,2.94 11.28,2.69 10.34,2.69 10.34,1.76 11.41,1.76 11.41,1.07 9.03,1.07
N$18  (via drill 0.2)
  Top 0.09: R1.4 R2.3
  Top 0.1: R1.4 v5.34,2.13 | v11.69,3.32 U5.6
  Bottom 0.09: v11.69,3.32 10.5,3.32 9.06,1.88 5.94,1.88 5.69,2.13 v5.34,2.13
N$19
  Top 0.09: U5.5 12.79,2.82 C7.3
N$20  (via drill 0.2)
  Top 0.254: U$35.61 v20.3,17.88
  Bottom 0.254: v20.3,17.88 20.75,18.34 C36.4 R7.4
N$21  (via drill 0.2)
  Top 0.09: U2.11 v1,2.69
  Bottom 0.09: v1,2.69 0.69,3.01 0.69,6.97 0.91,7.19 C114.4
N$22  (via drill 0.2)
  Top 0.09: U2.10 v1,3.19
  Bottom 0.09: R105.3 1.19,4.1 1.34,3.94 1.34,3.44 1.09,3.19 v1,3.19
N$23  (via drill 0.2)
  Top 0.09: U2.6 v4.5,3.69
  Bottom 0.09: R8.3 R100.4 3.5,4.07 3.88,3.69 v4.5,3.69
QSPI_SS  (via drill 0.2)
  Top 0.09: U$35.75 v14.7,17.88
  Bottom 0.09: v14.7,17.88 15.12,18.3 R4.3
RP_A0  (via drill 0.2)
  Top 0.09: U9.5 v22.62,9.85 22.19,9.85 21.89,10.15 U$35.45
  Bottom 0.09: v22.62,9.85 12.5,9.85 12.25,10.1 11.15,10.1 11.12,10.06 10.56,10.06 10.49,10.13 10.26,10.13 10.19,10.06 9.63,10.06 9.6,10.1 U1.20
RP_A1  (via drill 0.2)
  Top 0.09: U9.6 v23.25,9.35 22.28,9.35 21.88,9.75 U$35.44
  Bottom 0.09: v23.25,9.35 12.25,9.35 11.96,9.63 10.56,9.63 10.49,9.56 10.26,9.56 10.19,9.63 9.63,9.63 9.6,9.6 U1.19
RP_A2  (via drill 0.2)
  Top 0.09: U9.7 v22.62,8.85 22.38,8.85 21.88,9.35 U$35.43
  Bottom 0.09: v22.62,8.85 12,8.85 11.71,9.13 9.94,9.13 9.87,9.06 9.63,9.06 9.6,9.1 U1.18
RP_A3  (via drill 0.2)
  Top 0.09: U9.8 v23.25,8.35 22.5,8.35 21.9,8.95 U$35.42
  Bottom 0.09: v23.25,8.35 11.75,8.35 11.46,8.63 10.56,8.63 10.49,8.56 10.26,8.56 10.19,8.63 6.85,8.63 U1.17
RP_A4  (via drill 0.2)
  Top 0.09: U11.12 v10.38,7.85 10.41,7.85 11.11,8.55 U$35.20
  Bottom 0.09: U1.16 24.75,8.6 24,7.85 v10.38,7.85
RP_A5  (via drill 0.2)
  Top 0.09: U11.13 v9.75,8.35 10.53,8.35 11.13,8.95 U$35.19
  Bottom 0.09: U1.15 24.75,9.1 23.71,8.06 11.66,8.06 11.38,8.35 v9.75,8.35
RP_A6  (via drill 0.2)
  Top 0.09: U11.14 v10.38,8.85 10.62,8.85 11.12,9.35 U$35.18
  Bottom 0.09: U1.14 24.62,9.6 23.62,8.6 23.4,8.6 23.37,8.63 23.13,8.63 23.06,8.56 11.91,8.56 11.62,8.85 v10.38,8.85
RP_A7  (via drill 0.2)
  Top 0.09: U11.15 v9.75,9.35 10.72,9.35 11.12,9.75 U$35.17
  Bottom 0.09: U1.13 24.62,10.1 23.59,9.06 22.81,9.06 22.74,9.13 22.51,9.13 22.47,9.1 12.12,9.1 11.88,9.35 v9.75,9.35
RP_A8  (via drill 0.2)
  Top 0.09: U12.16 v10.38,15.35 U$35.3
  Bottom 0.09: U1.3 25,15.1 23.96,16.13 22.81,16.13 22.74,16.06 22.51,16.06 22.47,16.1 12.62,16.1 11.88,15.35 v10.38,15.35
RP_A9  (via drill 0.2)
  Top 0.09: U12.17 v9.75,15.85 11.03,15.85 11.13,15.75 U$35.2
  Bottom 0.09: U1.2 25,15.6 24,16.6 23.4,16.6 23.37,16.56 22.81,16.56 22.74,16.63 22.51,16.63 22.47,16.6 12.38,16.6 11.62,15.85 v9.75,15.85
RP_A10  (via drill 0.2)
  Top 0.09: U10.3 v22.62,16.35 | U$35.28 v15.5,6.82
  Route15 0.09: v22.62,16.35 22.62,15.91 23.31,15.22 23.47,15.22 24.06,14.63 24.06,10.47 23.59,10.01 23.06,10.01 22.91,10.16 22.19,10.16 20.69,8.66 20.69,6.69 20.44,6.44 15.69,6.44 15.5,6.63 v15.5,6.82
  Bottom 0.09: v22.62,16.35 12.5,16.35 11.71,15.56 10.56,15.56 10.49,15.63 10.26,15.63 10.19,15.56 9.63,15.56 9.6,15.6 U1.31
RP_A11  (via drill 0.2)
  Top 0.09: U12.18 v10.38,16.35 10.91,16.35 11.11,16.15 U$35.1
  Bottom 0.09: U1.1 25,16.1 23.96,17.13 23.13,17.13 23.1,17.1 12.12,17.1 11.38,16.35 v10.38,16.35
RP_A12  (via drill 0.2)
  Top 0.09: U11.16 v10.38,9.85 10.81,9.85 11.11,10.15 U$35.16
  Bottom 0.09: U1.12 24.62,10.6 23.62,9.6 23.4,9.6 23.37,9.63 23.13,9.63 23.06,9.56 12.41,9.56 12.12,9.85 v10.38,9.85
RP_A13  (via drill 0.2)
  Top 0.09: U12.15 v9.75,14.85 11.03,14.85 11.13,14.95 U$35.4
  Bottom 0.09: U1.4 24.88,14.6 23.88,15.6 23.4,15.6 23.37,15.56 22.81,15.56 22.74,15.63 22.51,15.63 22.47,15.6 12.88,15.6 12.12,14.85 v9.75,14.85
RP_A14  (via drill 0.2)
  Top 0.09: U12.14 v10.38,14.35 10.94,14.35 11.14,14.15 U$35.6
  Bottom 0.09: U1.5 24.75,14.1 23.71,15.13 22.81,15.13 22.74,15.06 22.51,15.06 22.47,15.1 13.12,15.1 12.38,14.35 v10.38,14.35
RP_A15  (via drill 0.2)
  Top 0.09: U11.17 v9.75,10.35 10.53,10.35 11.13,10.95 U$35.14
  Bottom 0.09: U1.11 24.62,11.1 23.59,10.06 22.81,10.06 22.74,10.13 22.51,10.13 22.47,10.1 12.62,10.1 12.38,10.35 v9.75,10.35
RP_A16  (via drill 0.2)
  Top 0.09: U11.18 v10.38,10.85 10.62,10.85 11.12,11.35 U$35.13
  Bottom 0.09: U1.10 24.38,11.6 23.41,10.63 23.06,10.63 22.99,10.56 12.91,10.56 12.62,10.85 v10.38,10.85
RP_A17  (via drill 0.2)
  Top 0.09: U12.13 v9.75,13.85 11.03,13.85 11.13,13.75 U$35.7
  Bottom 0.09: U1.6 24.62,13.6 23.62,14.6 23.4,14.6 23.37,14.56 22.81,14.56 22.74,14.63 22.51,14.63 22.47,14.6 13.38,14.6 12.62,13.85 v9.75,13.85
RP_A18  (via drill 0.2)
  Top 0.09: U12.11 8.62,12.95 8.72,12.85 v9.75,12.85 9.96,13.06 11,13.06 11.12,12.95 U$35.9
  Bottom 0.09: U1.9 24.5,12.1 22.96,13.63 22.51,13.63 22.47,13.6 13.88,13.6 13.12,12.85 v9.75,12.85
RP_DC_BUS  (via drill 0.2)
  Top 0.09: U$35.21 v12.7,6.83 v12.69,6.82
  Bottom 0.09: Q3.2 8.69,5.94 9.12,6.38 R13.4 9.5,6.69 9.62,6.82 v12.69,6.82
RP_IO0  (via drill 0.2)
  Top 0.09: U9.4 v23.25,10.35 22.06,10.35 21.86,10.55 U$35.46
  Bottom 0.09: v23.25,10.35 12.75,10.35 12.46,10.63 10.56,10.63 10.49,10.56 10.26,10.56 10.19,10.63 9.63,10.63 9.6,10.6 U1.21
RP_IO1  (via drill 0.2)
  Top 0.09: U9.3 v22.62,10.85 21.97,10.85 21.87,10.95 U$35.47
  Bottom 0.09: v22.62,10.85 13,10.85 12.75,11.1 10.53,11.1 10.49,11.13 10.26,11.13 10.19,11.06 9.63,11.06 9.6,11.1 U1.22
RP_IO2  (via drill 0.2)
  Top 0.09: U9.2 v23.25,11.35 U$35.48
  Bottom 0.09: v23.25,11.35 13.12,11.35 12.84,11.63 9.63,11.63 9.6,11.6 U1.23
RP_IO3  (via drill 0.2)
  Top 0.09: U10.9 v22.62,13.35 | U$35.36 18.72,7.43 v18.72,6.82
  Route15 0.09: v22.62,13.35 22.62,12.6 18.72,8.69 v18.72,6.82
  Bottom 0.09: v22.62,13.35 14,13.35 13.21,12.56 9.63,12.56 9.6,12.6 U1.25
RP_IO4  (via drill 0.2)
  Top 0.09: U10.8 v23.25,13.85 | U$35.38 v19.5,6.82
  Route15 0.09: v23.25,13.85 23.25,12.57 19.5,8.82 v19.5,6.82
  Bottom 0.09: v23.25,13.85 13.75,13.85 13,13.1 10.53,13.1 10.49,13.06 10.26,13.06 10.19,13.13 9.63,13.13 9.6,13.1 U1.26
RP_IO5  (via drill 0.2)
  Top 0.09: U10.7 v22.62,14.35 | U$35.37 v19.1,6.83 v19.11,6.82
  Route15 0.09: v22.62,14.35 22.94,14.04 22.94,12.6 19.11,8.77 v19.11,6.82
  Bottom 0.09: v22.62,14.35 13.5,14.35 12.71,13.56 10.56,13.56 10.49,13.63 10.26,13.63 10.19,13.56 9.63,13.56 9.6,13.6 U1.27
RP_IO6  (via drill 0.2)
  Top 0.09: U10.6 v23.25,14.85 | U$35.40 v20.3,6.82
  Route15 0.09: v23.25,14.85 23.81,14.29 23.81,11.07 23.53,10.79 23.06,10.79 22.81,10.54 22.12,10.54 20.3,8.71 v20.3,6.82
  Bottom 0.09: v23.25,14.85 13.25,14.85 12.5,14.1 10.53,14.1 10.49,14.06 10.26,14.06 10.19,14.13 9.63,14.13 9.6,14.1 U1.28
RP_IO7  (via drill 0.2)
  Top 0.09: U10.5 v22.62,15.35 | U$35.39 v19.9,6.82 v19.91,6.82
  Route15 0.09: v22.62,15.35 22.62,14.88 23.31,14.19 23.38,14.19 23.56,14.01 23.56,11.16 23.44,11.04 23.06,11.04 22.96,11.13 22.25,11.13 19.91,8.79 v19.91,6.82
  Bottom 0.09: v22.62,15.35 13,15.35 12.21,14.56 10.56,14.56 10.49,14.63 10.26,14.63 10.19,14.56 9.63,14.56 9.6,14.6 U1.29
RP_LED_0
  Top 0.09: U$35.57 21.91,14.95 22.31,15.35 22.31,17.25 24.41,19.35 R97.4
RP_LED_1
  Top 0.09: R98.4 25.22,20.48 22.09,17.35 22.09,15.54 21.91,15.35 U$35.58
SYS_A0
  Top 0.09: J1.4 28.38,10.1 27.62,9.35 U9.15
SYS_A1
  Top 0.09: J1.3 28.38,9.6 27.62,8.85 U9.14
SYS_A2
  Top 0.09: J1.2 28.38,9.1 27.62,8.35 U9.13
SYS_A3
  Top 0.09: J1.1 28.38,8.6 27.62,7.85 U9.12
SYS_A4
  Top 0.09: J2.16 5.12,8.6 5.38,8.35 U11.8
SYS_A5
  Top 0.09: J2.15 5.12,9.1 5.38,8.85 U11.7
SYS_A6
  Top 0.09: J2.14 5.12,9.6 5.38,9.35 U11.6
SYS_A7
  Top 0.09: J2.13 5.12,10.1 5.38,9.85 U11.5
SYS_A8
  Top 0.09: J2.3 4.62,15.1 5.38,15.85 U12.4
SYS_A9
  Top 0.09: J2.2 4.62,15.6 5.38,16.35 U12.3
SYS_A10
  Top 0.09: J1.15 27.88,15.6 27.62,15.85 U10.17
SYS_A11
  Top 0.09: J2.1 4.62,16.1 5.38,16.85 U12.2
SYS_A12
  Top 0.09: J2.12 5.12,10.6 5.38,10.35 U11.4
SYS_A13
  Top 0.09: J2.4 4.62,14.6 5.38,15.35 U12.5
SYS_A14
  Top 0.09: J2.5 4.62,14.1 5.38,14.85 U12.6
SYS_A15
  Top 0.09: J2.11 5.12,11.1 5.38,10.85 U11.3
SYS_A16
  Top 0.09: J2.10 5.12,11.6 5.38,11.35 U11.2
SYS_A17
  Top 0.09: J2.6 4.62,13.6 5.38,14.35 U12.7
SYS_A18
  Top 0.09: J2.9 4.12,12.1 5.38,13.35 U12.9
SYS_IO0
  Top 0.09: J1.5 28.38,10.6 27.62,9.85 U9.16
SYS_IO1
  Top 0.09: J1.6 28.38,11.1 27.62,10.35 U9.17
SYS_IO2
  Top 0.09: J1.7 28.38,11.6 28.04,11.26 28.04,11.23 27.65,10.85 U9.18
SYS_IO3
  Top 0.09: J1.9 27.25,12.6 26.9,12.95 U10.11
SYS_IO4
  Top 0.09: J1.10 27.88,13.1 27.62,13.35 U10.12
SYS_IO5
  Top 0.09: J1.11 27.88,13.6 27.62,13.85 U10.13
SYS_IO6
  Top 0.09: J1.12 27.88,14.1 27.62,14.35 U10.14
SYS_IO7
  Top 0.09: J1.13 27.88,14.6 27.62,14.85 U10.15
SYS_VCC_5V0  (via drill 0.2)
  Bottom 0.09: R8.4 v4.78,5.51
  pour Top (no thermals): 2.84,3.04 3.38,3.04 3.38,4.88 4.97,4.88 4.97,6.1 3.91,6.1 3.91,8.1 2.69,8.1 2.69,12.44 3.88,12.44 3.88,12.72 1.78,12.72 1.78,6.79 2.84,6.79
TPS2121_ST  (via drill 0.2)
  Top 0.09: U2.9 v1,3.69
  Route15 0.09: v1,3.69 1,5.1 1.81,5.91 5.06,5.91 5.44,5.54 v6.09,5.54
  Bottom 0.09: Q3.7 8.09,6.29 Q3.6 Q3.5 7.31,5.94 6.91,5.54 R11.4 v6.1,5.54 v6.09,5.54
USB_D_C_N  (via drill 0.2)
  Top 0.09: U$35.66 18.3,17.57 18.19,17.68 18.19,17.88 v18.3,17.88
  Bottom 0.09: v18.3,17.88 18.19,17.88 18.19,18.66 18.56,19.04 19.66,19.04 20.6,19.98 22.14,19.98 22.43,19.69 R6.3
USB_D_C_P  (via drill 0.2)
  Top 0.09: U$35.67 17.9,17.57 18.01,17.68 18.01,17.88 v17.91,17.88
  Bottom 0.09: v17.91,17.88 18.01,17.88 18.01,18.74 18.49,19.22 19.55,19.22 20.49,20.16 22.14,20.16 22.44,20.45 R5.3
USB_D_N  (via drill 0.2)
  Top 0.09: v27.06,6.79 27.16,6.79 27.16,6.47 27,6.31 J4.B7 27,5.04 27.09,4.94 28.41,4.94 28.5,5.04 J4.A7
  Bottom 0.09: R6.4 23.52,19.98 25.53,19.98 28.75,16.76 28.75,8.85 27.16,7.26 27.16,6.79 v27.06,6.79
USB_D_P  (via drill 0.2)
  Top 0.09: v27.45,6.79 27.34,6.79 27.34,6.47 27.5,6.32 27.5,5.69 | J4.A6 27.5,5.69 | J4.B6 27.54,5.65 27.5,5.69
  Bottom 0.09: R5.4 23.52,20.16 25.6,20.16 28.93,16.83 28.93,8.77 27.34,7.19 27.34,6.79 v27.45,6.79
VBUS_VCC_5V0  (via drill 0.2)
  Bottom 0.09: R9.4 4.81,7.19 5.12,6.88 5.12,2.6 4.97,2.44 4.97,1.54
  other vias: 30.16,3.47 30.16,2.97 29.66,2.97 29.66,3.47 15.34,1.44 15.34,1.01 3.09,1.41 3.09,0.94 3.56,1.41 3.56,0.94
  pour Top (no thermals): 25.12,6.13 25.66,6.13 25.66,5.01 29.81,5.01 29.81,6.19 30.38,6.19 30.38,2.79 25.12,2.79
  pour Bottom: 20.34,3.72 30.38,3.72 30.38,2.79 22.19,2.79 22.19,0.54 2.84,0.54 2.84,1.6 20.34,1.6
  pour Top (no thermals): 14.44,1.82 15.56,1.82 15.56,0.54 14.44,0.54
  pour Top (no thermals): 2.84,2.85 3.38,2.85 3.38,1.6 3.75,1.6 3.75,0.66 2.84,0.66
VCC_1V1  (via drill 0.2)
  Top 0.09: U$35.65 v18.7,17.88
  Top 0.254: U$35.51 v22.02,12.55 v22.03,12.54 22.47,12.54 C33.4 | U$35.10 11.18,12.55 v10.91,12.28 10.88,12.25 10.43,12.69 C35.4 | U$35.32 v17.1,6.83 v17.11,6.82
  Bottom 0.254: C32.4 C34.4 17.09,6.8 v17.11,6.82
  other vias: 19.12,20.16 19.5,20.16 19.88,20.16 18.75,20.16 18.38,20.16 18,20.16
  pour Top (no thermals): 17.09,18.19 18.91,18.19 18.91,20.04 20,20.04 20,20.6 17.09,20.6
  pour Bottom (no thermals): 17.09,20.6 20,20.6 20,19.85 17.09,19.85
  pour Route15: 17.09,20.29 22.19,20.29 22.19,12.35 17.41,12.35 17.41,6.66 16.78,6.66 16.78,7.85 10.72,7.85 10.72,17.54 17.09,17.54
VCC_3V3  (via drill 0.2)
  Top 0.254: U$35.64 v19.1,17.88 v19.09,17.88 | U$35.68 v17.5,17.88 | U$35.69 v17.1,17.88 v17.09,17.88 | U$35.29 v15.9,6.83 v15.89,6.82 | U$35.24 v13.91,6.82 | U$35.76 v14.3,17.87 v14.31,17.88
  Bottom 0.254: C38.4 v19.1,17.88 v19.09,17.88 | C37.4 v17.5,17.88 | C16.4 16.69,18.29 v17.09,17.88 | v15.89,6.82 15.89,6.36 C15.4 | v13.91,6.82 13.47,6.38 C17.4 | C29.4 v21.69,7.32 | C31.4 v11.28,17.54 | C1.4 v11.25,7.32 | C30.4 v14.31,17.88 | R7.3 v21.56,19.63 | C18.4 v21.69,17.54
  other vias: 8.38,2.94 8.38,3.32 8.38,2.57 8.38,2.19 8.38,3.69
  pour Top (rank 2, no thermals): 12.41,16.66 14.19,16.66 14.19,18.01 14.44,18.01 14.44,16.66 17,16.66 17,18.01 17.66,18.01 17.66,16.66 18.97,16.66 18.97,18.01 19.25,18.01 19.25,16.66 20.81,16.66 20.81,19.76 21.81,19.76 21.81,15.63 20.75,15.63 20.75,12.26 21.84,12.26 21.84,12.01 20.75,12.01 20.75,8.66 21.81,8.66 21.81,7.13 20.66,7.13 20.66,8.01 16,8.01 16,6.69 15.78,6.69 15.78,8.01 14.06,8.01 14.06,6.69 13.78,6.69 13.78,8.01 12.41,8.01 12.41,5.29 8.72,5.29 8.72,4.72 6.97,4.72 6.97,6.76 11.03,6.76 11.03,8.26 12.22,8.26 12.22,10.41 11.16,10.41 11.16,10.66 12.22,10.66 12.22,14.41 11.16,14.41 11.16,14.66 12.22,14.66 12.22,16.44 11.06,16.44 11.06,17.73 12.41,17.73
  pour Top (no thermals): 5.72,3.51 6.97,3.51 6.97,4.76 8.72,4.76 8.72,1.07 7.09,1.07 7.09,1.82 6.34,1.82 6.34,2.69 5.72,2.69
VCC_5V0  (via drill 0.2)
  Top 0.254: U12.20 v8.25,17.85 8.25,18.07 C8.4 | U10.20 v26.25,17.82 26.25,18.07 C9.4 | U9.20 26.25,11.91 26.45,12.12 v27.08,12.12 | U11.20 8.6,12.1 v9.06,12.1
  Bottom 0.09: R12.3 v10.87,6.38 v10.88,6.38 | R11.3 v7.15,6.35 v7.16,6.35 | R14.3 | R14.3 v15.09,5.07 | R15.3 R14.3 | R16.3 C10.4
  Bottom 0.254: C10.4 27.72,12.79 27.53,12.6 27.09,12.6 | U1.8 27.09,12.6 | v27.08,12.12 27.09,12.13 27.09,12.6
  other vias: 10.72,3.76 11.34,3.76 2.41,4.41 2.41,4.79 2.41,1.41 2.41,0.94
  pour Top (no thermals): 10.59,3.19 11.47,3.19 11.47,5.07 10.59,5.07
  pour Route15: 6.94,18.01 9.19,18.01 9.19,6.72 11.28,6.72 11.28,5.26 16.72,5.26 16.72,3.72 24.97,3.72 24.97,18.01 27.19,18.01 27.19,2.79 22.19,2.79 22.19,0.57 15.69,0.57 15.69,2.79 2.66,2.79 2.66,0.66 2.16,0.66 2.16,5.38 6.94,5.38
  pour Top (no thermals): 2.16,4.91 2.66,4.91 2.66,0.66 2.16,0.66

### Text on the board
tPlace: O2_PROM_ISP REV. A00 / sdz-mods.com | L | R